# Altium schematic sheet Discharge_circuit_1.SchDoc
size 246 x 129 mm
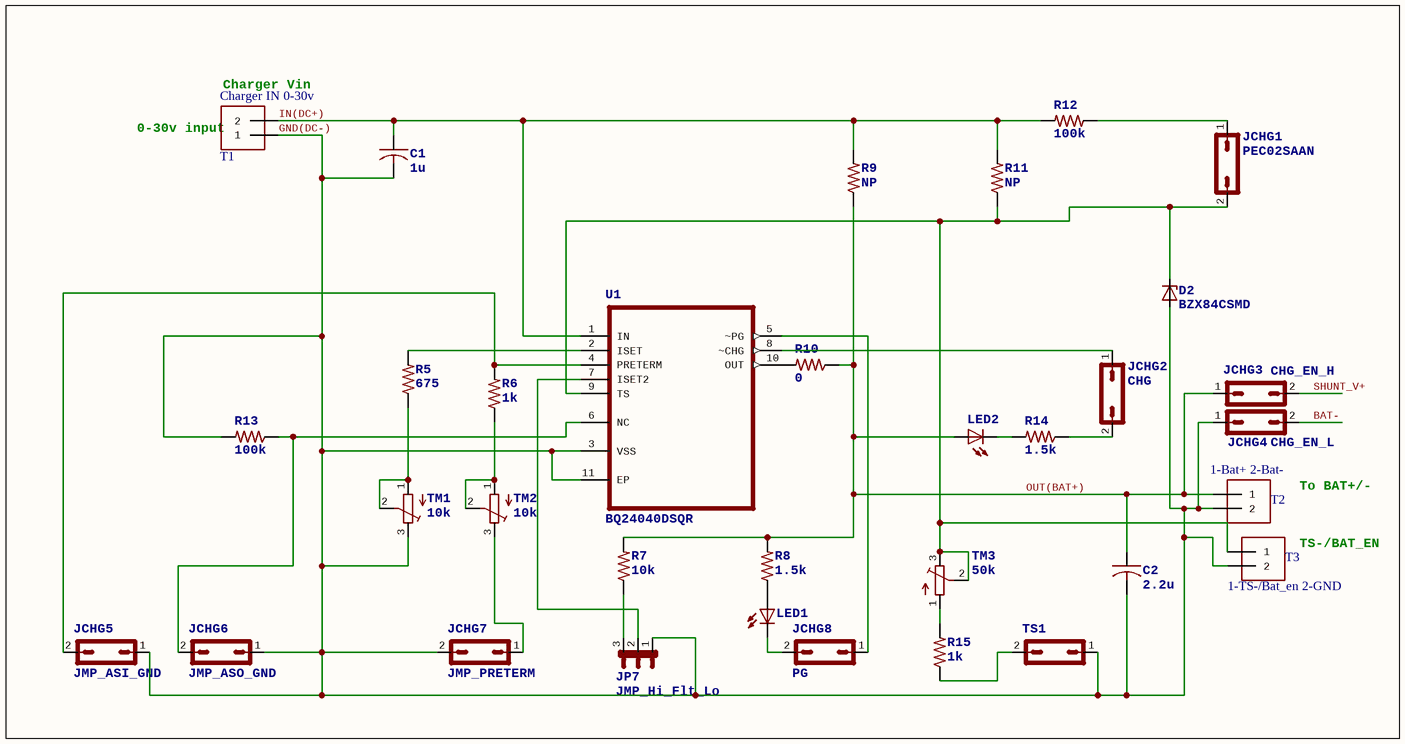
[diagram p0: Discharge_circuit_1.SchDoc]

## Parts
C1  1u  [C1206]
C2  2.2u  [C1206]
D2  BZX84CSMD  [TO236]
JCHG1  PEC02SAAN  [JP1]
JCHG2  CHG  [JP1]
JCHG3  CHG_EN_H  [JP1]
JCHG4  CHG_EN_L  [JP1]
JCHG5  JMP_ASI_GND  [JP1]
JCHG6  JMP_ASO_GND  [JP1]
JCHG7  JMP_PRETERM  [JP1]
JCHG8  PG  [JP1]
JP7  JMP_Hi_Flt_Lo  [JP2]
LED1  (no value)  [CHIPLED_1206]
LED2  (no value)  [CHIPLED_1206]
R5  675  [R1206]
R6  1k  [R1206]
R7  10k  [R1206]
R8  1.5k  [R1206]
R9  NP  [R1206]
R10  0  [R0603]
R11  NP  [R1206]
R12  100k  [R1206]
R13  100k  [R1206]
R14  1.5k  [R1206]
R15  1k  [R1206]
T1  Charger IN 0-30v  [1X2-3.5MM]
T2  1-Bat+ 2-Bat-  [1X2-3.5MM]
T3  1-TS-/Bat_en 2-GND  [1X2-3.5MM]
TM1  10k  [TC33X]
TM2  10k  [TC33X]
TM3  50k  [TC33X]
TS1  (no value)  [JP1]
U1  BQ24040DSQR  [SON40P200X200X80-10N]

## Nets
BAT-: JCHG4.2
GND(DC-): C1.2 C2.2 D2.A JCHG4.1 JCHG5.1 JCHG6.1 JCHG7.2 JP7.1 R13.2 T1.1 T2.2 T3.2 TM1.3(E) TS1.1 U1.3(VSS) U1.11(EP)
IN(DC+): C1.1 R9.2 R11.2 R12.2 T1.2 U1.1(IN)
OUT(BAT+): C2.1 JCHG3.1 LED2.A R7.2 R8.2 R9.1 R10.1 T2.1
SHUNT_V+: JCHG3.2
NetD2_C: D2.C JCHG1.2 R11.1 T3.1 TM3.2(S) TM3.3(E) U1.9(TS)
NetJCHG1_1: JCHG1.1 R12.1
NetJCHG2_1: JCHG2.1 U1.8(~CHG)
NetJCHG2_2: JCHG2.2 R14.1
NetJCHG5_2: JCHG5.2 R6.2 U1.4(PRETERM)
NetJCHG6_2: JCHG6.2 R13.1 U1.6(NC)
NetJCHG7_1: JCHG7.1 TM2.3(E)
NetJCHG8_1: JCHG8.1 U1.5(~PG)
NetJCHG8_2: JCHG8.2 LED1.C
NetJP7_2: JP7.2 U1.7(ISET2)
NetJP7_3: JP7.3 R7.1
NetLED1_A: LED1.A R8.1
NetLED2_C: LED2.C R14.2
NetR5_1: R5.1 TM1.1(A) TM1.2(S)
NetR5_2: R5.2 U1.2(ISET)
NetR6_1: R6.1 TM2.1(A) TM2.2(S)
NetR10_2: R10.2 U1.10(OUT)
NetR15_1: R15.1 TS1.2
NetR15_2: R15.2 TM3.1(A)

## Notes on the sheet
- (near T1) Charger Vin
- (near T1) 0-30v input
- To BAT+/-
- TS-/BAT_EN

## Library data of the parts
C1 C2 = C-USC1206: CAPACITOR, American symbol
D2 = BZX84CSMD: Z DIODE
JCHG1-JCHG8 TS1 = JP1Q: JUMPER
JP7 = JP2E: JUMPER
LED1 LED2 = LEDCHIPLED_1206: LED   OSRAM: - CHIPLED LG R971, LG N971, LY N971, LG Q971, LY Q971, LO R971, LY R971 LH N974, LH R974 LS Q976, LO Q976, LY Q976 LO Q996 - Hyper CHIPLED LW Q18S LB Q993, LB Q99A, LB R99A - SideLED LS A670, LO A670, LY A670, LG A670, LP A670 LB A673, LV A673, LT A673, LW A673 LH A674 LY A675 LS A676, LA A676, LO A676, LY A676, LW A676 LS A679, LY A679, LG A679 -  Hyper Micro SIDELED® LS Y876, LA Y876, LO Y876, LY Y876 LT Y87S - SmartLED LW L88C, LW L88S LB L89C, LB L89S, LG L890 LS L89K, LO L89K, LY L89K LS L896, LA L896, LO L896, LY L896 - TOPLED LS T670, LO T670, LY T670, LG T670, LP T670 LSG T670, LSP T670, LSY T670, LOP T670, LYG T670 LG T671, LOG T671, LSG T671 LB T673, LV T673, LT T673, LW T673 LH T674 LS T676, LA T676, LO T676, LY T676, LB T676, LH T676, LSB T676, LW T676 LB T67C, LV T67C, LT T67C, LS T67K, LO T67K, LY T67K, LW E67C LS E67B, LA E67B, LO E67B, LY E67B, LB E67C, LV E67C, LT E67C LW T67C LS T679, LY T679, LG T679 LS T770, LO T770, LY T770, LG T770, LP T770 LB T773, LV T773, LT T773, LW T773 LH T774 LS E675, LA E675, LY E675, LS T675 LS T776, LA T776, LO T776, LY T776, LB T776 LHGB T686 LT T68C, LB T68C - Hyper Mini TOPLED® LB M676 - Mini TOPLED Santana® LG M470 LS M47K, LO M47K, LY M47K    Source: http://www.osram.convergy.de/
R5-R15 = R-US_R1206: RESISTOR, American symbol
T1-T3 = 1X2-3.5MM: 3.5mm Terminal block    http://www.ladyada.net/library/pcb/eaglelibrary.html
TM1-TM3 = TRIMPOTTC33X: SMT trimmer potentiometer part number TC33X    http://www.ladyada.net/library/eagle
U1 = BQ24040DSQR: Single Cell Li-Ion Battery Charger; MPN: BQ24040DSQR; OC_FARNELL: -; OC_NEWARK: 50R7512; PACKAGE: SON-10; SUPPLIER: Texas Instruments